# Altium schematic sheet Regulator.SchDoc
size A
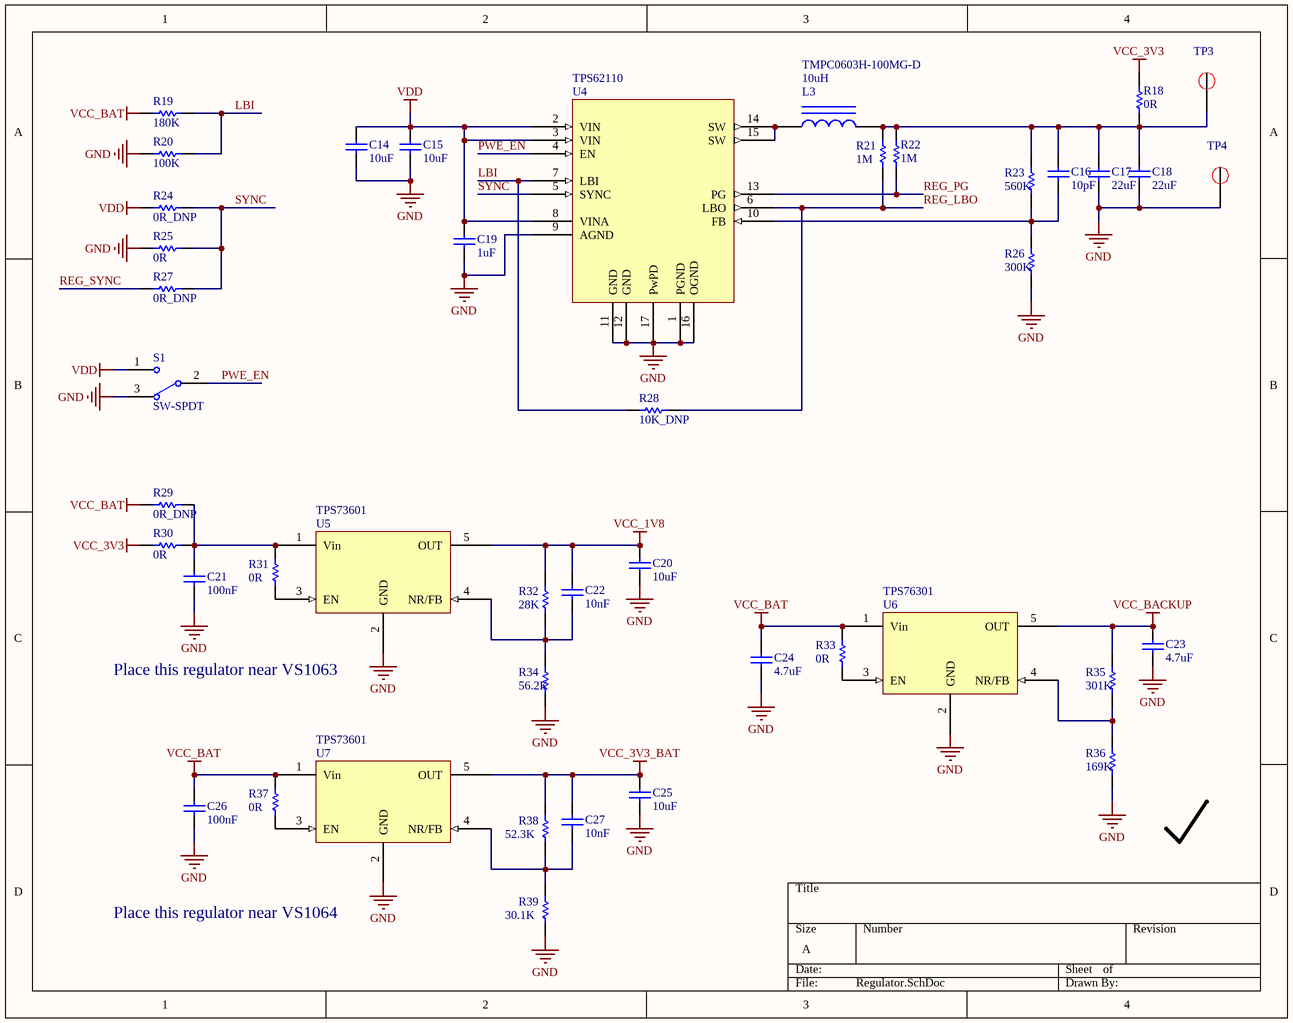
[diagram p0: Regulator.SchDoc]

## Parts
C14  value 10uF  [C1206]  (hidden comment: Cap Semi)
C15  value 10uF  [C1206]  (hidden comment: Cap Semi)
C16  value 10pF  [0603PKG]  (hidden comment: Cap Semi)
C17  value 22uF  [C1206]  (hidden comment: Cap Semi)
C18  value 22uF  [C1206]  (hidden comment: Cap Semi)
C19  value 1uF  [0603PKG]  (hidden comment: Cap Semi)
C20  value 10uF  [0603PKG]  (hidden comment: Cap Semi)
C21  value 100nF  [0603PKG]  (hidden comment: Cap Semi)
C22  value 10nF  [0603PKG]  (hidden comment: Cap Semi)
C23  value 4.7uF  [C0805]  (hidden comment: Cap Semi)
C24  value 4.7uF  [C0805]  (hidden comment: Cap Semi)
C25  value 10uF  [0603PKG]  (hidden comment: Cap Semi)
C26  value 100nF  [0603PKG]  (hidden comment: Cap Semi)
C27  value 10nF  [0603PKG]  (hidden comment: Cap Semi)
L3  TMPC0603H-100MG-D  value 10uH  [CAPM3216X18N]
R18  value 0R  [C0805]  (hidden comment: Res1)
R19  value 180K  [0603PKG]  (hidden comment: Res1)
R20  value 100K  [0603PKG]  (hidden comment: Res1)
R21  value 1M  [0603PKG]  (hidden comment: Res1)
R22  value 1M  [0603PKG]  (hidden comment: Res1)
R23  value 560K  [0603PKG]  (hidden comment: Res1)
R24  value 0R_DNP  [0603PKG]  (hidden comment: Res1)
R25  value 0R  [0603PKG]  (hidden comment: Res1)
R26  value 300K  [0603PKG]  (hidden comment: Res1)
R27  value 0R_DNP  [0603PKG]  (hidden comment: Res1)
R28  value 10K_DNP  [0603PKG]  (hidden comment: Res1)
R29  value 0R_DNP  [0603PKG]  (hidden comment: Res1)
R30  value 0R  [0603PKG]  (hidden comment: Res1)
R31  value 0R  [0603PKG]  (hidden comment: Res1)
R32  value 28K  [0603PKG]  (hidden comment: Res1)
R33  value 0R  [0603PKG]  (hidden comment: Res1)
R34  value 56.2K  [0603PKG]  (hidden comment: Res1)
R35  value 301K  [0603PKG]  (hidden comment: Res1)
R36  value 169K  [0603PKG]  (hidden comment: Res1)
R37  value 0R  [0603PKG]  (hidden comment: Res1)
R38  value 52.3K  [0603PKG]  (hidden comment: Res1)
R39  value 30.1K  [0603PKG]  (hidden comment: Res1)
S1  SW-SPDT  [Slide switch]
TP3  TP  [TP_15]  (value not drawn)
TP4  TP  [TP_15]  (value not drawn)
U4  value TPS62110  [QFN16-4*4*0.65]  (hidden comment: Buck converter)
U5  TPS73601  [SOT23-5]
U6  TPS76301  [SOT23-5]
U7  TPS73601  [SOT23-5]

## Nets
GND: C14.2 C15.2 C17.2 C18.2 C19.2 C20.2 C21.2 C23.2 C24.2 C25.2 C26.2 R20.2 R25.2 R26.1 R34.1 R36.1 R39.1 S1.3 TP4.1 U4.1(PGND) U4.9(AGND) U4.11(GND) U4.12(GND) U4.16(OGND) U4.17(PwPD) U5.2(GND) U6.2(GND) U7.2(GND)
VCC_1V8: C20.1 C22.1 R32.2 U5.5(OUT)
VCC_3V3: R18.1 R30.2
VCC_3V3_BAT: C25.1 C27.1 R38.2 U7.5(OUT)
VCC_BACKUP: C23.1 R35.2 U6.5(OUT)
VCC_BAT: C24.1 C26.1 R19.2 R29.2 R33.2 R37.2 U6.1(Vin) U7.1(Vin)
VDD: C14.1 C15.1 C19.1 R24.2 S1.1 U4.2(VIN) U4.3(VIN) U4.8(VINA)
LBI: R19.1 R20.1 R28.2 U4.7(LBI)
PWE_EN: S1.2 U4.4(EN)
REG_LBO: R21.1 R28.1 U4.6(LBO)
REG_PG: R22.2 U4.13(PG)
REG_SYNC: R27.2
SYNC: R24.1 R25.1 R27.1 U4.5(SYNC)
NetC16_1: C16.1 C17.1 C18.1 L3.2 R18.2 R21.2 R22.1 R23.2 TP3.1
NetC16_2: C16.2 R23.1 R26.2 U4.10(FB)
NetC21_1: C21.1 R29.1 R30.1 R31.2 U5.1(Vin)
NetC22_2: C22.2 R32.1 R34.2 U5.4(NR/FB)
NetC27_2: C27.2 R38.1 R39.2 U7.4(NR/FB)
NetL3_1: L3.1 U4.14(SW) U4.15(SW)
NetR31_1: R31.1 U5.3(EN)
NetR33_1: R33.1 U6.3(EN)
NetR35_1: R35.1 R36.2 U6.4(NR/FB)
NetR37_1: R37.1 U7.3(EN)

## Notes on the sheet
- Place this regulator near VS1063
- Place this regulator near VS1064

## Library data of the parts
C14-C27 = Cap Semi: Capacitor (Semiconductor SIM Model); Published: 8-Jun-2000; LatestRevisionDate: 29-May-2009; LatestRevisionNote: IPC-7351 Footprint Added.; PackageReference: C1206; Publisher: Altium Limited; PackageDescription: Chip Capacitor
L3 = Inductor Iron: Magnetic-Core Inductor; Published: 24-Mar-1999; LatestRevisionDate: 17-Jul-2002; LatestRevisionNote: Re-released for DXP Platform.; PackageReference: AXIAL-0.9; Publisher: Altium Limited; PackageDescription: Axial Device, Thru-Hole; 2 Leads; 0.9 in Pin Spacing
R18-R39 = Res1: Resistor; Published: 8-Jun-2000; LatestRevisionDate: 17-Jul-2002; LatestRevisionNote: Re-released for DXP Platform.; PackageReference: AXIAL-0.3; Publisher: Altium Limited; PackageDescription: Axial Device, Thru-Hole; 2 Leads; 0.3 in Pin Spacing
S1 = SW-SPDT: SPDT Subminiature Toggle Switch, Right Angle Mounting, Vertical Actuation; Published: 24-Mar-1999; LatestRevisionDate: 17-Dec-2003; LatestRevisionNote: Schematic revised, PCB Footprint replaced.; DatasheetVersion: 05-Dec-2000; PackageReference: TL36WW15050; Publisher: Altium Limited; PackageDescription: Switch; 4 Leads; ComponentLink1Description: Manufacturer Link; ComponentLink1URL: http://www.apem.com
TP3 TP4 = Test Point
U4 = TPS62110: 17-V, 1.5-A, SYNCHRONOUS STEP-DOWN CONVERTER
U5 U7 = TPS73601: TPS736xx Cap-Free, NMOS, 400-mA Low-Dropout Regulator with Reverse Current  Protection
U6 = TPS76301: TPS763 Low-Power 150-mA Low-Dropout Linear Regulators